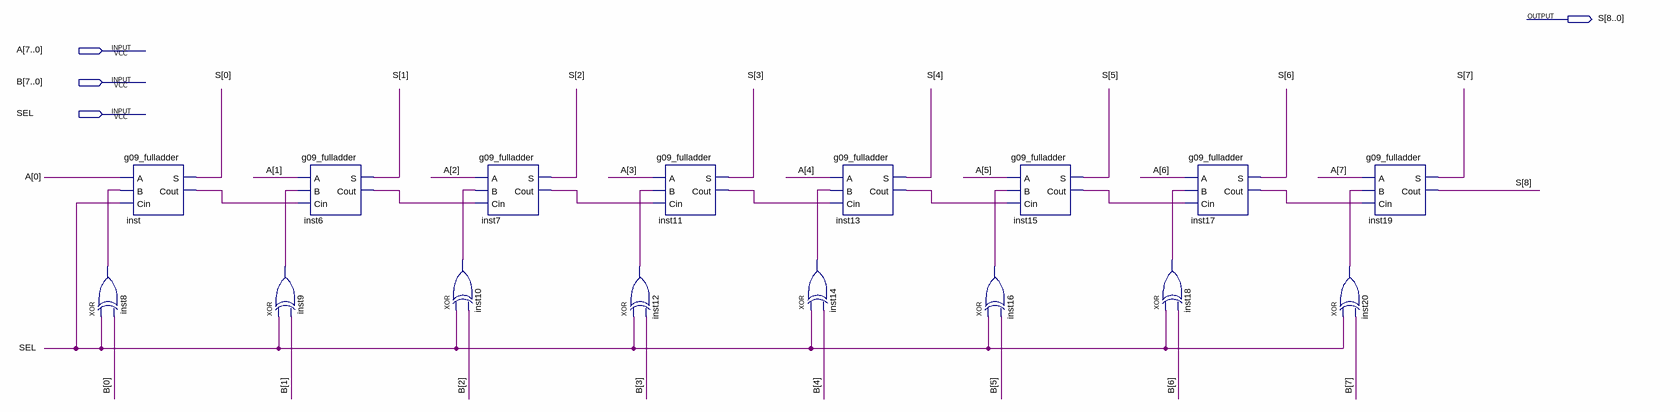
[diagram p0: schematic sheet]
// Quartus schematic g09_addersubtractor.bdf as structural Verilog: 16 symbols, 4 pins
module g09_addersubtractor (
  input  [7:0] A,
  input  [7:0] B,
  input  SEL,
  output [8:0] S
);

  wire inst6_cout, inst7_cout, inst8_out, inst9_out, inst10_out, inst11_cout, inst12_out, inst13_cout,
       inst14_out, inst15_cout, inst16_out, inst17_cout, inst18_out, inst20_out, inst_cout;

  xor inst8 (inst8_out, SEL, B[0]);
  g09_fulladder inst (.A(A[0]), .B(inst8_out), .Cin(SEL), .S(S[0]), .Cout(inst_cout));
  g09_fulladder inst6 (.A(A[1]), .B(inst9_out), .Cin(inst_cout), .S(S[1]), .Cout(inst6_cout));
  xor inst9 (inst9_out, SEL, B[1]);
  xor inst10 (inst10_out, SEL, B[2]);
  g09_fulladder inst7 (.A(A[2]), .B(inst10_out), .Cin(inst6_cout), .S(S[2]), .Cout(inst7_cout));
  g09_fulladder inst11 (.A(A[3]), .B(inst12_out), .Cin(inst7_cout), .S(S[3]), .Cout(inst11_cout));
  xor inst12 (inst12_out, SEL, B[3]);
  xor inst14 (inst14_out, SEL, B[4]);
  g09_fulladder inst13 (.A(A[4]), .B(inst14_out), .Cin(inst11_cout), .S(S[4]), .Cout(inst13_cout));
  g09_fulladder inst15 (.A(A[5]), .B(inst16_out), .Cin(inst13_cout), .S(S[5]), .Cout(inst15_cout));
  xor inst16 (inst16_out, SEL, B[5]);
  xor inst18 (inst18_out, SEL, B[6]);
  g09_fulladder inst17 (.A(A[6]), .B(inst18_out), .Cin(inst15_cout), .S(S[6]), .Cout(inst17_cout));
  g09_fulladder inst19 (.A(A[7]), .B(inst20_out), .Cin(inst17_cout), .S(S[7]), .Cout(S[8]));
  xor inst20 (inst20_out, SEL, B[7]);
endmodule
